# Altium schematic sheet ServoPower.SchDoc
size A4
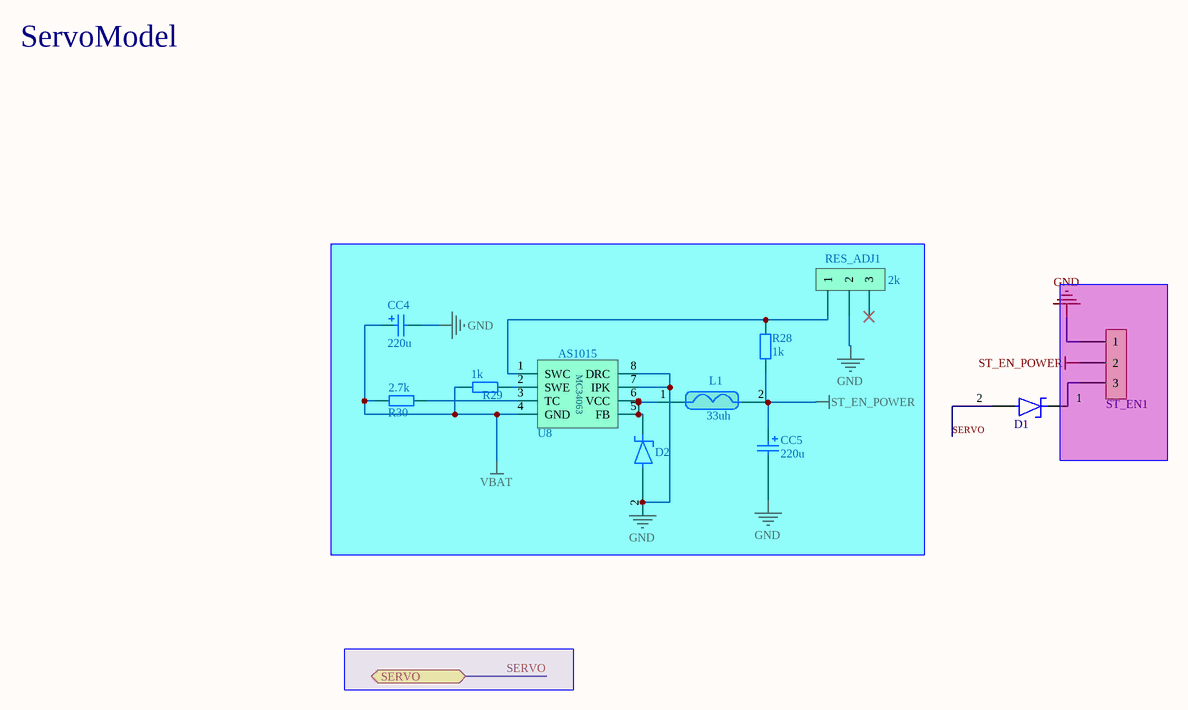
[diagram p0: ServoPower.SchDoc]

## Parts
CC4  Capacitance: 220u  [CAPMP6032X26N]  (hidden comment: Cap Tan C)
CC5  Capacitance: 220u  [CAPMP6032X26N]  (hidden comment: Cap Tan C)
D1  贴片二极管  [二极管SMA]  (value not drawn)
D2  贴片二极管  [二极管SMA]  (value not drawn)
L1  33uh  [电感7.3X7.3]
R28  1k  [0805电阻]
R29  1k  [0805电阻]
R30  2.7k  [0805电阻]
RES_ADJ1  2k  [Header3]
ST_EN1  Header3  [Header3]  (value not drawn)
U8  AS1015  [MC34063]

## Ports
SERVO

## Nets
GND: CC4.1 CC5.1 D2.2 RES_ADJ1.2 ST_EN1.1 U8.7(IPK) U8.8(DRC)
ST_EN_POWER: CC5.2 L1.2 R28.1 ST_EN1.2
VBAT: CC4.2 R29.1 R30.1 U8.4(GND)
SERVO: D1.2 ; port SERVO
NetD1_1: D1.1 ST_EN1.3
NetD2_1: D2.1 L1.1 U8.5(FB) U8.6(VCC)
NetR28_2: R28.2 RES_ADJ1.1 U8.1(SWC)
NetR29_2: R29.2 U8.2(SWE)
NetR30_2: R30.2 U8.3(TC)

Not connected (* = marked no-connect by the designer): RES_ADJ1 3*

## Notes on the sheet
- ServoModel

## Library data of the parts
CC4 CC5 = Cap Tan C: Polarized Capacitor (Radial); Voltage: 16V; Published: 8-Jun-2000; Revision: July-2002: Re-released for DXP Platform.; Publisher: Altium Limited
L1 = 电感
R28-R30 = 0805电阻
RES_ADJ1 = Header3
U8 = MC34063